# EAGLE design OPBS-Brain (EAGLE 6.4)

## Sheet 1 of 3
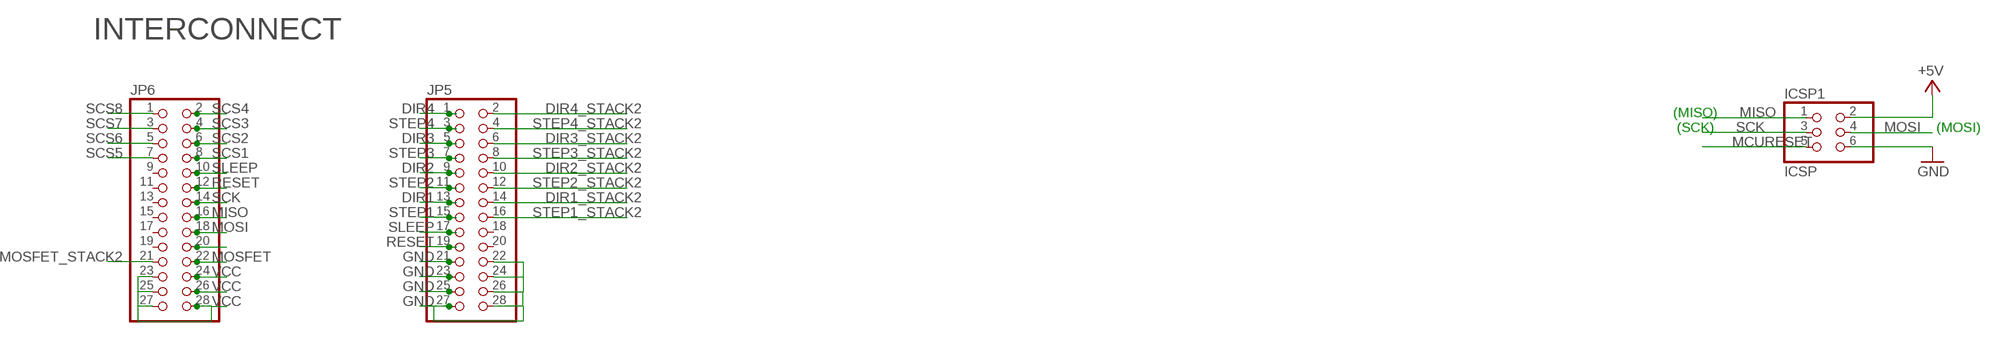
[diagram p0: schematic, sheet 1]

### Parts
ICSP1  ICSP  PINHD-2X3  [2X03]
JP5  PINHD-2X14  [2X14]
JP6  PINHD-2X14  [2X14]

### Nets
DIR1: JP5.13
DIR1_STACK2: JP5.14
DIR2: JP5.9
DIR2_STACK2: JP5.10
DIR3: JP5.5
DIR3_STACK2: JP5.6
DIR4: JP5.1
DIR4_STACK2: JP5.2
GND: ICSP1.6 JP5.21 JP5.22 JP5.23 JP5.24 JP5.25 JP5.26 JP5.27 JP5.28 ; also sheet 2,3
MCURESET: ICSP1.5
MISO: ICSP1.1 JP6.16
MOSFET: JP6.22
MOSFET_STACK2: JP6.21
MOSI: ICSP1.4 JP6.18
PULLUPVCC: JP6.20
RESET: JP5.19 JP6.12
SCK: ICSP1.3 JP6.14
SCS1: JP6.8
SCS2: JP6.6
SCS3: JP6.4
SCS4: JP6.2
SCS5: JP6.7
SCS6: JP6.5
SCS7: JP6.3
SCS8: JP6.1
SLEEP: JP5.17 JP6.10
STEP1: JP5.15
STEP1_STACK2: JP5.16
STEP2: JP5.11
STEP2_STACK2: JP5.12
STEP3: JP5.7
STEP3_STACK2: JP5.8
STEP4: JP5.3
STEP4_STACK2: JP5.4
VCC: ICSP1.2 JP6.23 JP6.24 JP6.25 JP6.26 JP6.27 JP6.28 ; supply symbol labelled +5V ; also sheet 2
Unconnected: JP5.18 JP5.20 JP6.9 JP6.11 JP6.13 JP6.15 JP6.17 JP6.19

### Notes on the sheet
- INTERCONNECT
- (MISO)
- (SCK) | (MOSI)

## Sheet 2 of 3
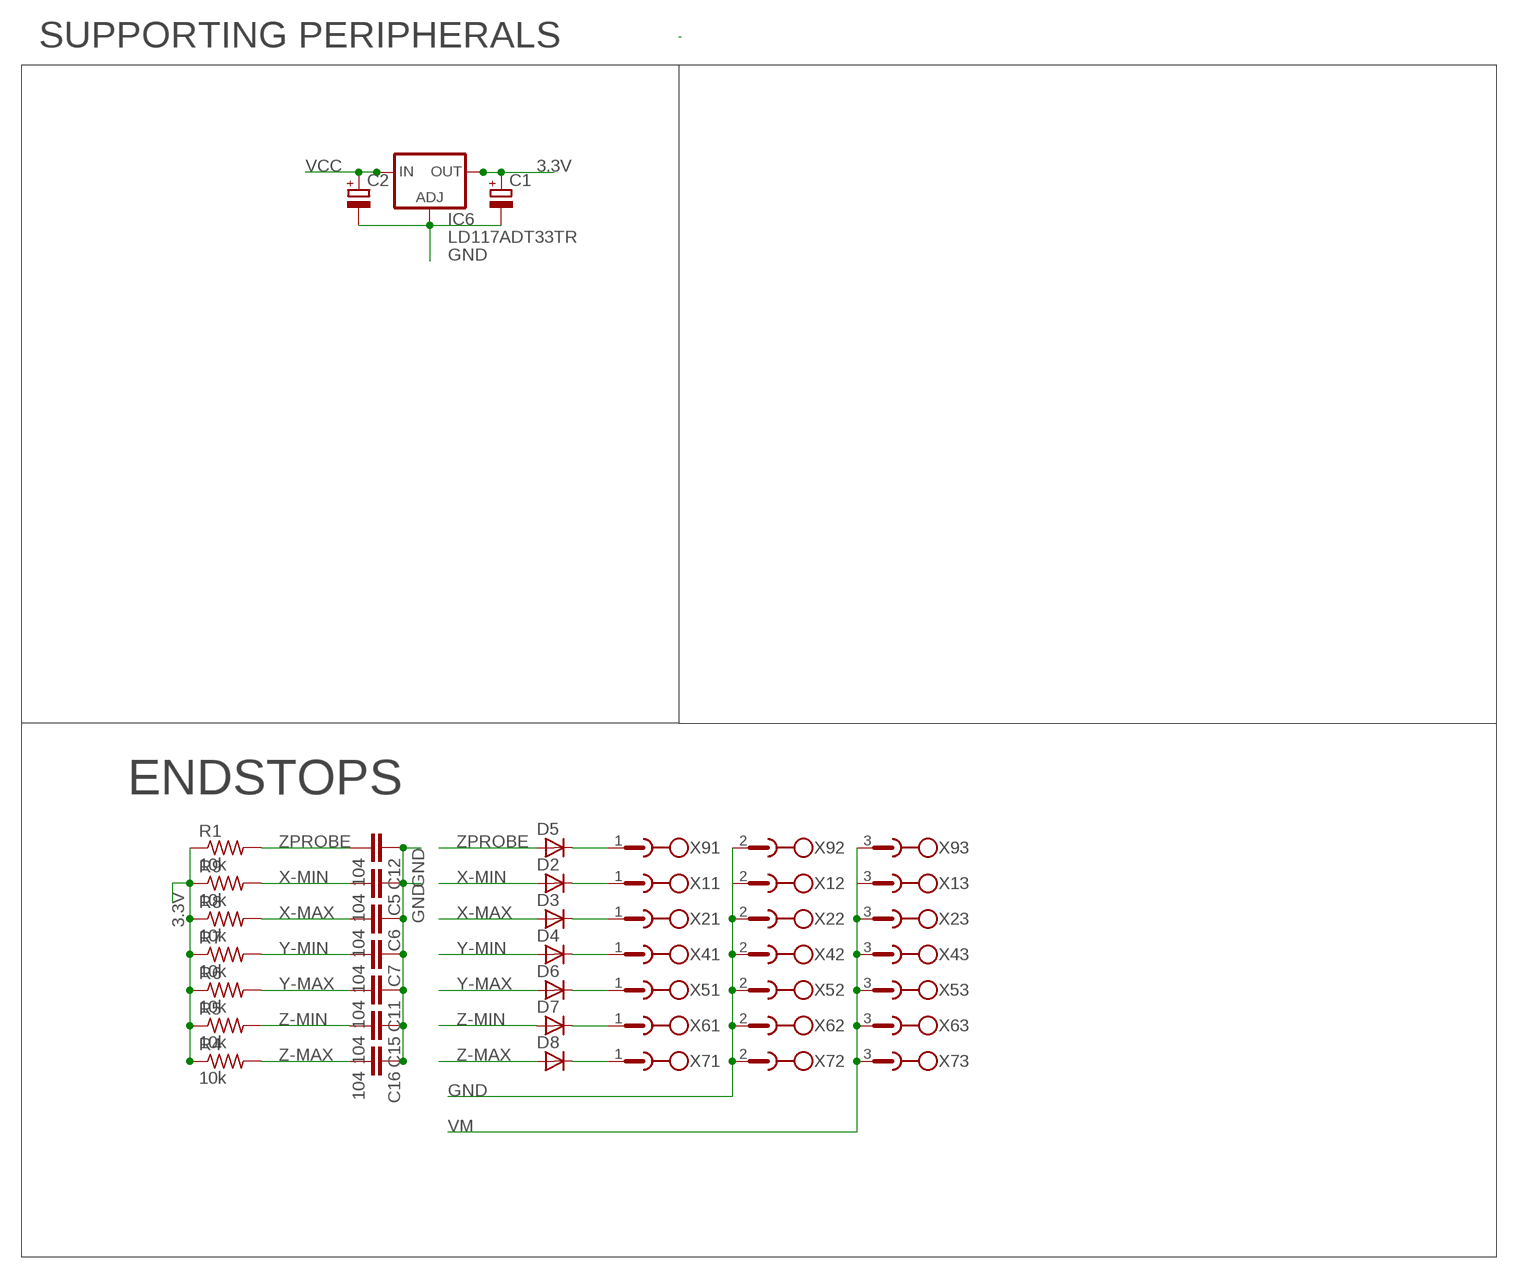
[diagram p1: schematic, sheet 2]

### Parts
C1  CPOL-EUE  [PANASONIC_E]
C2  CPOL-EUE  [PANASONIC_E]
C5  104  C-EUC1206  [C1206]
C6  104  C-EUC1206  [C1206]
C7  104  C-EUC1206  [C1206]
C11  104  C-EUC1206  [C1206]
C12  104  C-EUC1206  [C1206]
C15  104  C-EUC1206  [C1206]
C16  104  C-EUC1206  [C1206]
D2  D-SOD-87  [SOD87]
D3  D-SOD-87  [SOD87]
D4  D-SOD-87  [SOD87]
D5  D-SOD-87  [SOD87]
D6  D-SOD-87  [SOD87]
D7  D-SOD-87  [SOD87]
D8  D-SOD-87  [SOD87]
IC6  LD117ADT33TR  [DPACK]
R1  10k  R-US_M1206  [M1206]
R4  10k  R-US_M1206  [M1206]
R5  10k  R-US_M1206  [M1206]
R6  10k  R-US_M1206  [M1206]
R7  10k  R-US_M1206  [M1206]
R8  10k  R-US_M1206  [M1206]
R9  10k  R-US_M1206  [M1206]
X1  MC1.5/3  [MC1.5/3-G-3.81]
X2  MC1.5/3  [MC1.5/3-G-3.81]
X4  MC1.5/3  [MC1.5/3-G-3.81]
X5  MC1.5/3  [MC1.5/3-G-3.81]
X6  MC1.5/3  [MC1.5/3-G-3.81]
X7  MC1.5/3  [MC1.5/3-G-3.81]
X9  MC1.5/3  [MC1.5/3-G-3.81]

### Nets
3.3V: C1.+ IC6.4(OUT) R1.1 R4.1 R5.1 R6.1 R7.1 R8.1 R9.1
GND: C1.- C2.- C5.1 C6.1 C7.1 C11.1 C12.1 C15.1 C16.1 IC6.1(ADJ) X1.2 X2.2 X4.2 X5.2 X6.2 X7.2 X9.2 ; also sheet 1,3
N$2: D2.1(C) X1.1
N$6: D3.1(C) X2.1
N$7: D4.1(C) X4.1
N$9: D6.1(C) X5.1
N$10: D7.1(C) X6.1
N$11: D8.1(C) X7.1
VCC: C2.+ IC6.3(IN) ; also sheet 1
VM: X1.3 X2.3 X4.3 X5.3 X6.3 X7.3 X9.3
X-MAX: C6.2 D3.2(A) R8.2
X-MIN: C5.2 D2.2(A) R9.2
Y-MAX: C11.2 D6.2(A) R6.2
Y-MIN: C7.2 D4.2(A) R7.2
Z-MAX: C16.2 D8.2(A) R4.2
Z-MIN: C15.2 D7.2(A) R5.2
Z-PROBE-HIVOLT: D5.1(C) X9.1
ZPROBE: C12.2 D5.2(A) R1.2

### Notes on the sheet
- MEGA Conn.
- SUPPORTING PERIPHERALS
- LED
- ENDSTOPS
- AUX-3 | AUX-4

## Sheet 3 of 3
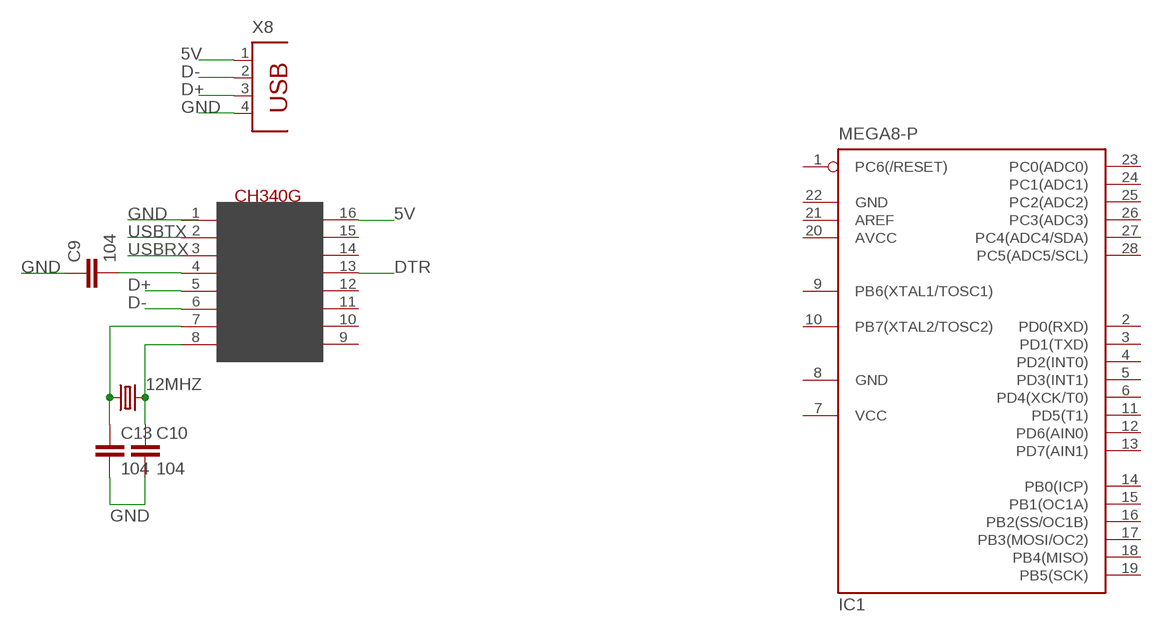
[diagram p2: schematic, sheet 3]

### Parts
12MHZ  CRYSTALHC49UP  [HC49UP@1]
C9  104  C-EUC1206  [C1206]
C10  104  C-EUC1206  [C1206]
C13  104  C-EUC1206  [C1206]
IC1  MEGA8-P  [DIL28-3]
U$1  CH340G  [SOIC16]
X8  PN61729  [PN61729]

### Nets
5V: U$1.16(VCC) X8.1
D+: U$1.5(D+) X8.3
D-: U$1.6(D-) X8.2
DTR: U$1.13(DTR)
GND: C9.1 C10.2 C13.2 X8.4 ; also sheet 1,2
N$5: 12MHZ.1 C13.1 U$1.7(XI)
N$8: 12MHZ.2 C10.1 U$1.8(XO)
N$13: C9.2 U$1.4(V3)
USBRX: U$1.3(RX)
USBTX: U$1.2(TX)
Unconnected: IC1.1(PC6(/RESET)) IC1.2(PD0(RXD)) IC1.3(PD1(TXD)) IC1.4(PD2(INT0)) IC1.5(PD3(INT1)) IC1.6(PD4(XCK/T0)) IC1.9(PB6(XTAL1/TOSC1)) IC1.10(PB7(XTAL2/TOSC2)) IC1.11(PD5(T1)) IC1.12(PD6(AIN0)) IC1.13(PD7(AIN1)) IC1.14(PB0(ICP)) IC1.15(PB1(OC1A)) IC1.16(PB2(SS/OC1B)) IC1.17(PB3(MOSI/OC2)) IC1.18(PB4(MISO)) IC1.19(PB5(SCK)) IC1.21(AREF) IC1.23(PC0(ADC0)) IC1.24(PC1(ADC1)) IC1.25(PC2(ADC2)) IC1.26(PC3(ADC3)) IC1.27(PC4(ADC4/SDA)) IC1.28(PC5(ADC5/SCL)) U$1.1(GND) U$1.9(CTS) U$1.10(DSR) U$1.11(RI) U$1.12(DCD) U$1.14(RTS) U$1.15(RS232)

## Power pins joined to a net without a drawn wire
AVCC: IC1.20(AVCC)
GND: IC1.8(GND) IC1.22(GND)
VCC: IC1.7(VCC)

## Library data of the parts
12MHZ = crystal:CRYSTAL: CRYSTAL; OC_FARNELL: unknown; OC_NEWARK: unknown
C1 C2 = rcl:CPOL-EU: POLARIZED CAPACITOR, European symbol
C5-C7 C9-C13 C15 C16 = rcl:C-EU: CAPACITOR, European symbol
D2-D8 = semicon-smd-ipc:D-: DIODE unfilled
IC1 = atmel:MEGA8-P: MICROCONTROLLER 8 Kbytes FLASH, 1 kbytes SRAM, 512 bytes EEPROM, USART, 4-channel 10 bit ADC, 2-channel 8 bit ADC Pin compatible with Atmega48, ATMega88, ATMega168 Source: avr.lbr; OC_FARNELL: unknown; OC_NEWARK: unknown
IC6 = v-reg:LD117A?*: Low drop fixed and adjustable positive voltage regulators 1 A Source: http://www.st.com/stonline/products/literature/ds/7194/ld1117axx.pdf
ICSP1 = pinhead:PINHD-2X3: PIN HEADER
JP5 JP6 = pinhead:PINHD-2X14: PIN HEADER
R1 R4-R9 = adafruit:R-US_: RESISTOR, American symbol
U$1 = usb-serial:CH340G
X1 X2 X4-X7 X9 = jt-con-phoenix-3.81:MC1.5/3: PHOENIX
X8 = con-berg:PN61729: BERG USB connector; OC_FARNELL: unknown; OC_NEWARK: unknown

## Net classes
1 power: width 0.6 mm, clearance 0.305 mm
2 gnd: width 0.305 mm, drill 0.711 mm, clearance 0.203 mm
3 usbvcc: width 0.508 mm, drill 0.711 mm, clearance 0.203 mm

## Board
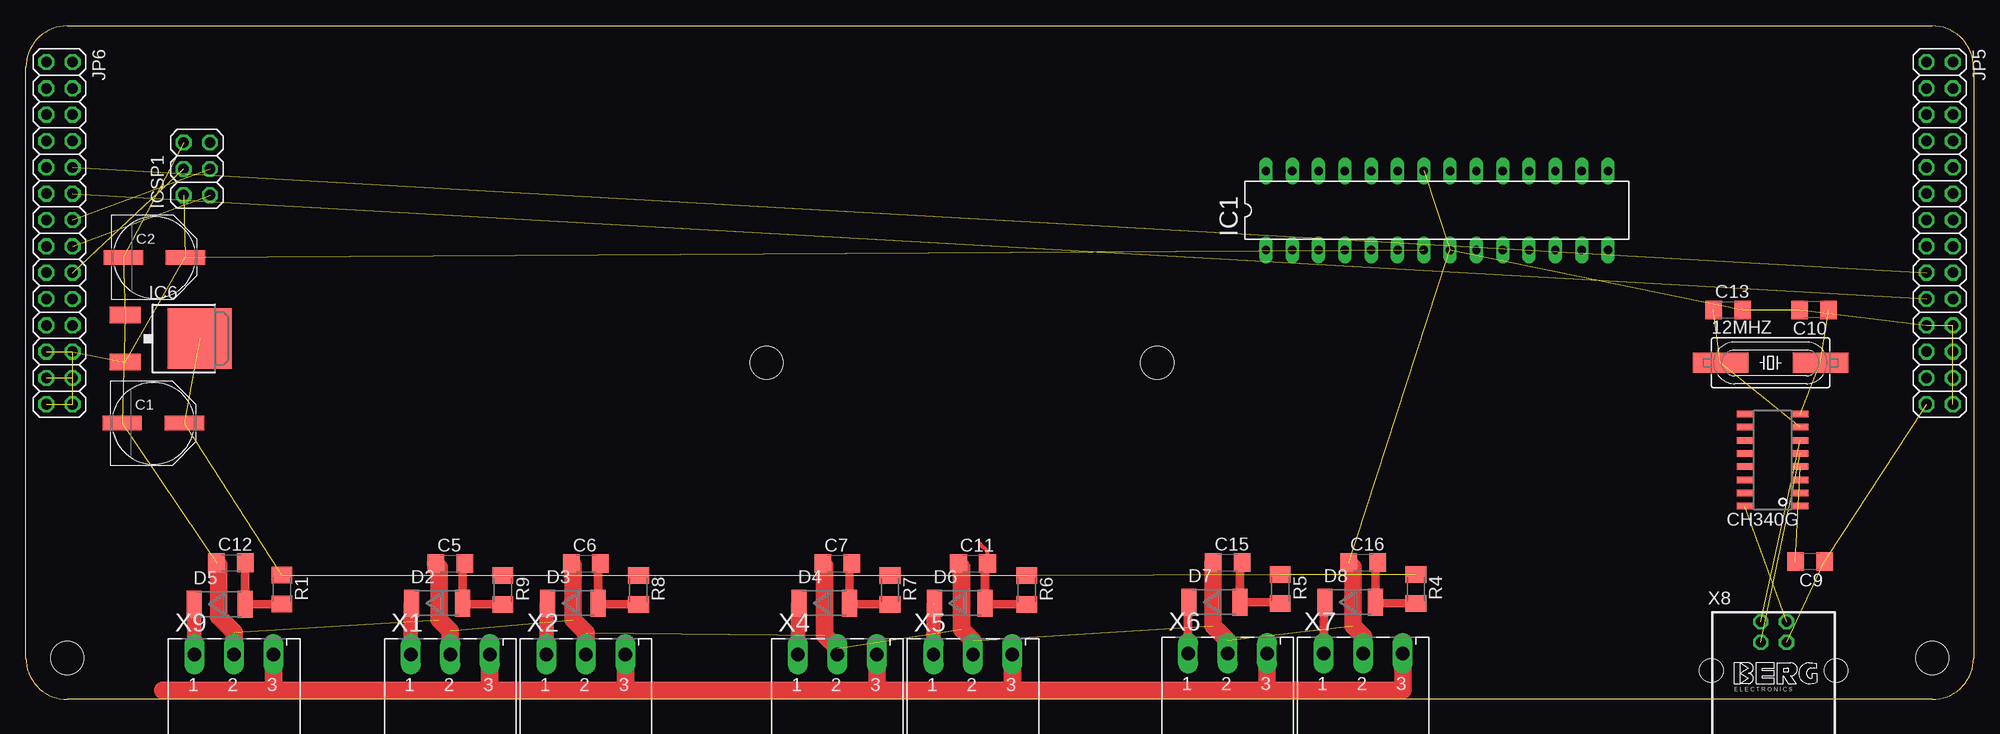
[diagram p3: board, top side]
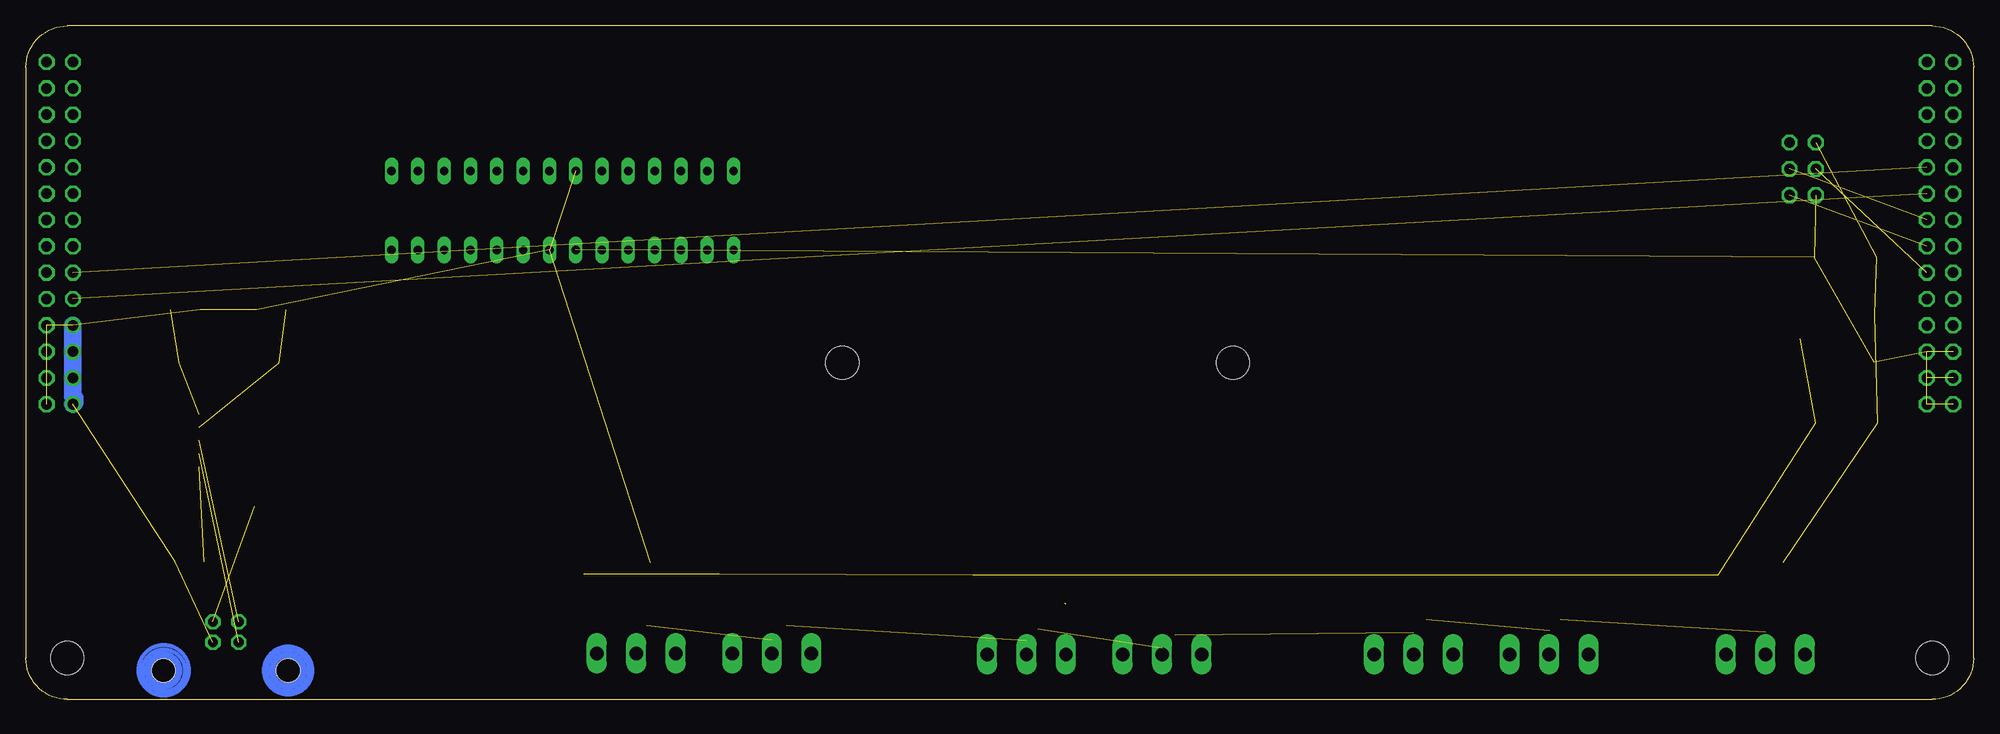
[diagram p4: board, bottom side, seen from below]

Size 188 x 65 mm. Coordinates in mm from the lower left corner, seen from the top.
Outline: 184,0 4.9,0 4,0 arc-90 0,4 0,61
Outline: 184,0 arc90 188,4
Outline: 188,61 arc90 184,65
Outline: 4,65 arc90 0,61
Outline: 4,65 184,65
Outline: 188,61 188,4
Outline: 184,0 arc90 188,4
Outline: 188,61 arc90 184,65
Outline: 4,65 arc90 0,61
Copper layers (1*16): Top 0.035mm / dielectric 1.5mm / Bottom 0.035mm
Design rules "dirt_cheap_dirty_boards.v1": minimum track width 5mil, minimum drill 12mil, track to track 5mil, track to pad 5mil, pad to pad 5mil, via to via 5mil, smd to smd 0mil, copper to edge 10mil, drill to drill 10mil, minimum pad ring 10mil, minimum via ring 6mil, stop-mask expansion 2mil, vias tented up to drill 25mil, thermal gap 10mil
Holes 3.2 mm at 4,4 184,4 71.5,32.5 109.2,32.5
bKeepout: area 1.5,1.5 to 6.5,6.5; area 181.5,1.5 to 186.5,6.5
bRestrict: area 181.5,1.5 to 186.5,6.5; area 1.5,1.5 to 6.5,6.5

### Footprints (pad centres in the part's own frame; a part is rotated, then mirrored left to right if it is on the bottom)
HC49UP@1 = smd 5.334 x 1.93: 1 -4.826,0; 2 4.826,0
PANASONIC_E = smd 3.8 x 1.4: + 3,0; - -3,0
C1206 = smd 1.6 x 1.8: 1 -1.4,0; 2 1.4,0
SOD87 = smd 1.45 x 2.6: 1 -2.445,0; 2 2.445,0
DIL28-3 = drill 0.813 long: 1 -16.51,-3.81; 2 -13.97,-3.81; 3 -11.43,-3.81; 4 -8.89,-3.81; 5 -6.35,-3.81; 6 -3.81,-3.81; 7 -1.27,-3.81; 8 1.27,-3.81; 9 3.81,-3.81; 10 6.35,-3.81; 11 8.89,-3.81; 12 11.43,-3.81; 13 13.97,-3.81; 14 16.51,-3.81; 15 16.51,3.81; 16 13.97,3.81; 17 11.43,3.81; 18 8.89,3.81; 19 6.35,3.81; 20 3.81,3.81; 21 1.27,3.81; 22 -1.27,3.81; 23 -3.81,3.81; 24 -6.35,3.81; 25 -8.89,3.81; 26 -11.43,3.81; 27 -13.97,3.81; 28 -16.51,3.81
DPACK = smd 1.6 x 3: 1 -2.28,-4.8; 3 2.28,-4.8 | smd 5.8 x 6.2: 4 0,2.38
2X03 = drill 1.016 octagon: 1 -2.54,-1.27; 2 -2.54,1.27; 3 0,-1.27; 4 0,1.27; 5 2.54,-1.27; 6 2.54,1.27
2X14 = drill 1.016 octagon: 1 -16.51,-1.27; 2 -16.51,1.27; 3 -13.97,-1.27; 4 -13.97,1.27; 5 -11.43,-1.27; 6 -11.43,1.27; 7 -8.89,-1.27; 8 -8.89,1.27; 9 -6.35,-1.27; 10 -6.35,1.27; 11 -3.81,-1.27; 12 -3.81,1.27; 13 -1.27,-1.27; 14 -1.27,1.27; 15 1.27,-1.27; 16 1.27,1.27; 17 3.81,-1.27; 18 3.81,1.27; 19 6.35,-1.27; 20 6.35,1.27; 21 8.89,-1.27; 22 8.89,1.27; 23 11.43,-1.27; 24 11.43,1.27; 25 13.97,-1.27; 26 13.97,1.27; 27 16.51,-1.27; 28 16.51,1.27
M1206 = smd 1.6 x 2: 1 -1.4,0; 2 1.4,0
SOIC16 = smd 0.635 x 1.524: 1 -4.445,-2.695; 2 -3.175,-2.695; 3 -1.905,-2.695; 4 -0.635,-2.695; 5 0.635,-2.695; 6 1.905,-2.695; 7 3.175,-2.695; 8 4.445,-2.695; 9 4.445,2.695; 10 3.175,2.695; 11 1.905,2.695; 12 0.635,2.695; 13 -0.635,2.695; 14 -1.905,2.695; 15 -3.175,2.695; 16 -4.445,2.695
MC1.5/3-G-3.81 = drill 1.3 long: 1 -3.81,8; 2 0,8; 3 3.81,8
PN61729 = drill 0.95 octagon: 1 1.25,4.71; 2 -1.25,4.71; 3 -1.25,2.71; 4 1.25,2.71 | hole 2.3: -6.02,0; 6.02,0

### Placement (x,y rotation side)
12MHZ  168.4,32.5 0 top
C1  12.3,26.67 0 top
C2  12.4,42.67 0 top
C5  40.97,13.11 0 top
C6  54.05,13.11 0 top
C7  78.33,13.11 0 top
C9  172.2,13.3 180 top
C10  172.6,37.6 180 top
C11  91.42,13.11 0 top
C12  19.8,13.2 0 top
C13  164.3,37.6 0 top
C15  116,13.21 0 top
C16  129.08,13.21 0 top
D2  39.7,9.3 0 top
D3  52.78,9.3 0 top
D4  77.06,9.3 0 top
D5  18.7,9.2 0 top
D6  90.15,9.3 0 top
D7  114.73,9.4 0 top
D8  127.81,9.4 0 top
IC1  136.2,47.2 0 top
IC6  14.4,34.83 270 top
ICSP1  16.5,51.2 90 top
JP5  184.73,45 270 top
JP6  3.24,45 270 top
R1  24.7,10.6 270 top
R4  134.16,10.67 270 top
R5  121.08,10.67 270 top
R6  96.6,10.57 270 top
R7  83.42,10.57 270 top
R8  59.13,10.57 270 top
R9  46.05,10.57 270 top
U$1  168.6,23.1 90 top
X1  40.97,-3.64 0 top
X2  54.05,-3.64 0 top
X4  78.33,-3.64 0 top
X5  91.42,-3.64 0 top
X6  116,-3.54 0 top
X7  129.08,-3.54 0 top
X8  168.7,2.8 0 top
X9  20.1,-3.64 0 top

### Tracks (layer width: path | path; a pad name or v marks a point on that pad's centre or on a via)
3.3V  (8 unrouted)
  Top 0.61: R4.1 134.2,12.07
5V  (1 unrouted)
D+  (1 unrouted)
D-  (1 unrouted)
GND  (21 unrouted)
  Top 1.676: X4.2 78.33,4.96 77.1,6.2 77.1,12.95 C7.1 | X5.2 91.42,5.68 90.3,6.8 90.3,12.83 C11.1 | X6.2 116,5.7 114.6,7.1 C15.1 | X7.2 129.08,6.12 128.1,7.1 128.1,12.79 C16.1 | X2.2 54.05,6.45 52.8,7.7 52.8,12.96 C6.1 | X1.2 40.97,6.63 39.9,7.7 39.9,12.78 C5.1 | X9.2 20.1,6.5 18.6,8 18.6,13 C12.1
  Bottom 1.676: JP5.27 183.3,28.65 183.3,29.1 183.46,29.26 JP5.25 JP5.23 JP5.21
MISO  (1 unrouted)
MOSI  (1 unrouted)
N$2
  Top 0.813: 37.16,9.21 D2.1
  Top 1.422: X1.1 37.16,9.21
N$5  (2 unrouted)
N$6
  Top 0.813: 50.24,9.21 D3.1
  Top 1.422: X2.1 50.24,9.21
N$7
  Top 0.813: 74.53,9.21 D4.1
  Top 1.422: X4.1 74.53,9.21
N$8  (2 unrouted)
N$9  (1 unrouted)
  Top 1.422: X5.1 87.61,9.21
N$10
  Top 0.813: X6.1 112.19,9.3 D7.1
N$11
  Top 0.813: X7.1 125.27,9.3 D8.1
N$13  (1 unrouted)
RESET  (1 unrouted)
SCK  (1 unrouted)
SLEEP  (1 unrouted)
VCC  (9 unrouted)
VM
  Top 1.676: 24,0.9 44.7,0.9 | 44.7,0.9 57.6,0.9 | 57.6,0.9 82.5,0.9 | 82.5,0.9 94.8,0.9 | 94.8,0.9 119.7,0.9 | 119.7,0.9 132.9,0.9 X7.3 | X6.3 119.81,1.31 119.7,0.9 | X5.3 95.23,1.03 94.8,0.9 | X4.3 82.14,0.95 82.5,0.9 | X2.3 57.86,0.86 57.6,0.9 | X1.3 44.78,1.58 44.7,0.9 | X9.3 23.91,0.99 24,0.9 | 24,0.9 13.2,0.9
X-MAX
  Top 0.813: R8.2 55.36,9.17 D3.2 55.23,12.88 C6.2
X-MIN
  Top 0.813: R9.2 42.27,9.17 D2.2 42.15,12.88 C5.2
Y-MAX
  Top 0.406: C11.2 92.82,14.28 92.1,15
  Top 0.813: R6.2 92.72,9.17 D6.2 92.59,12.88 C11.2
Y-MIN
  Top 0.813: R7.2 79.64,9.17 D4.2 79.51,12.88 C7.2
Z-MAX
  Top 0.813: R4.2 130.39,9.27 D8.2 130.26,12.98 C16.2
Z-MIN
  Top 0.813: C15.2 117.17,12.98 D7.2 120.95,9.4 R5.2
Z-PROBE-HIVOLT
  Top 0.61: 16.25,4.39 X9.1
  Top 1.422: D5.1 16.25,4.39
ZPROBE
  Top 0.813: R1.2 D5.2 21.14,13.14 C12.2
(copper drawn outside any net)
  shapes: Bottom circle x6

### Text on the board
Document: AUX-4
OPHWSILK: SCS4 | - | - | 5-8 | 1-4 | 1-4 | 5-8 | 5v | + | + | + | SCS3 | SCS2 | SCS1 | SLEEP | RESET | STALL | STALL | SCK | STALL | STALL | FAULT | FAULT | FAULT | FAULT | MISO | C1 | C3 | C1 | C3 | C1 | C3 | C1 | C3 | MOSI | C2 | C4 | C2 | C4 | C2 | C4 | 22P | C2 | C4 | 22P | VCC | C6 | C6 | C6 | C6 | SW1 | 330 | 330 | 3K3 | 330 | 330 | 3K3 | 330 | 330 | 3K3 | 330 | 330 | 3K3 | DRV8711 | DRV8711 | DRV8711 | DRV8711 | C5 | C5 | C5 | C5 | 5V | 12MHZ | 5V | 10R | 5V | 2 | 1 | R050 | R050 | R050 | R050 | R050 | R050 | R050 | R050 | CSD / 88537 / ND | CSD / 88537 / ND | CSD / 88537 / ND | CSD / 88537 / ND | C7 | CSD / 88537 / ND | CSD / 88537 / ND | CSD / 88537 / ND | CSD / 88537 / ND | C7 | CSD / 88537 / ND | CSD / 88537 / ND | CSD / 88537 / ND | CSD / 88537 / ND | C7 | CSD / 88537 / ND | CSD / 88537 / ND | CSD / 88537 / ND | CSD / 88537 / ND | C7 | MOSFET | C8 | C8 | C8 | C8 | C8 | PROBE | MIN | MAX | MIN | MAX | MIN | MAX | USB | - | +